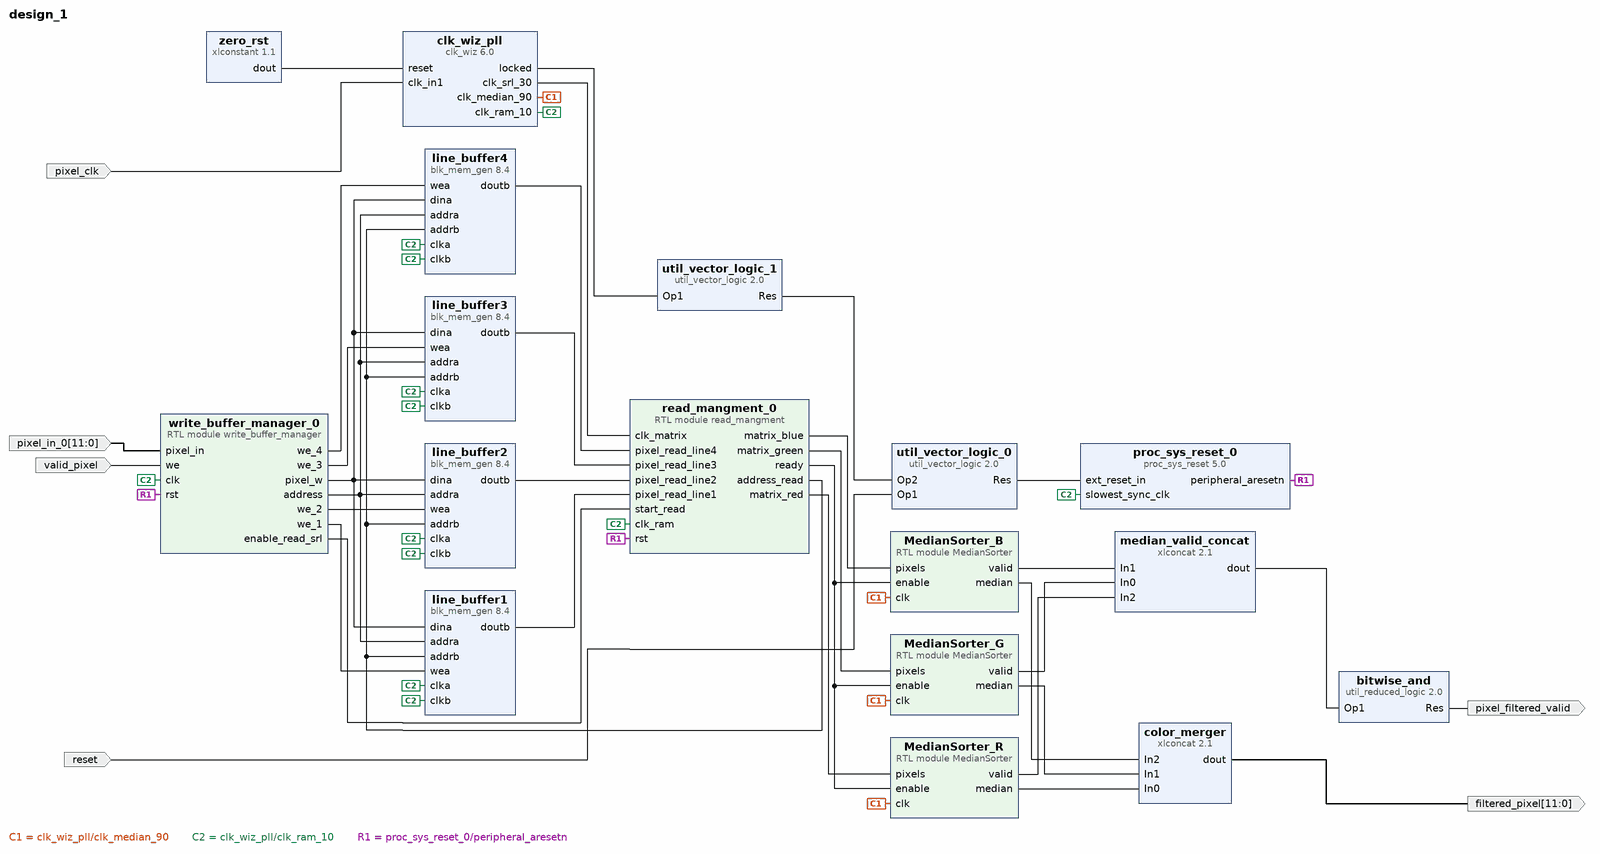
[diagram p0: block diagram of the top level]
# Vivado block design design_1, xc7a100tcsg324-1, Vivado 2024.1
create_bd_design design_1

create_bd_port -dir I -type clk pixel_clk
set_property -dict {CONFIG.FREQ_HZ 10000000} [get_bd_ports pixel_clk]
create_bd_port -dir O pixel_filtered_valid
create_bd_port -dir O -from 11 -to 0 filtered_pixel
create_bd_port -dir I -type rst reset
set_property -dict {CONFIG.POLARITY ACTIVE_HIGH} [get_bd_ports reset]
create_bd_port -dir I -from 11 -to 0 pixel_in_0
create_bd_port -dir I valid_pixel

create_bd_cell -type ip -vlnv xilinx.com:ip:blk_mem_gen:8.4 line_buffer1
set_property -dict [list \
  CONFIG.Enable_A Always_Enabled \
  CONFIG.Enable_B Always_Enabled \
  CONFIG.Fill_Remaining_Memory_Locations true \
  CONFIG.Memory_Type Simple_Dual_Port_RAM \
  CONFIG.Register_PortB_Output_of_Memory_Primitives false \
  CONFIG.Write_Depth_A 640 \
  CONFIG.Write_Width_A 12 \
  CONFIG.use_bram_block Stand_Alone \
] [get_bd_cells line_buffer1]
create_bd_cell -type ip -vlnv xilinx.com:ip:blk_mem_gen:8.4 line_buffer2
set_property -dict [list \
  CONFIG.Enable_A Always_Enabled \
  CONFIG.Enable_B Always_Enabled \
  CONFIG.Fill_Remaining_Memory_Locations true \
  CONFIG.Memory_Type Simple_Dual_Port_RAM \
  CONFIG.Register_PortB_Output_of_Memory_Primitives false \
  CONFIG.Write_Depth_A 640 \
  CONFIG.Write_Width_A 12 \
  CONFIG.use_bram_block Stand_Alone \
] [get_bd_cells line_buffer2]
create_bd_cell -type ip -vlnv xilinx.com:ip:blk_mem_gen:8.4 line_buffer3
set_property -dict [list \
  CONFIG.Enable_A Always_Enabled \
  CONFIG.Enable_B Always_Enabled \
  CONFIG.Fill_Remaining_Memory_Locations true \
  CONFIG.Memory_Type Simple_Dual_Port_RAM \
  CONFIG.Register_PortB_Output_of_Memory_Primitives false \
  CONFIG.Write_Depth_A 640 \
  CONFIG.Write_Width_A 12 \
  CONFIG.use_bram_block Stand_Alone \
] [get_bd_cells line_buffer3]
create_bd_cell -type ip -vlnv xilinx.com:ip:blk_mem_gen:8.4 line_buffer4
set_property -dict [list \
  CONFIG.Enable_A Always_Enabled \
  CONFIG.Enable_B Always_Enabled \
  CONFIG.Fill_Remaining_Memory_Locations true \
  CONFIG.Memory_Type Simple_Dual_Port_RAM \
  CONFIG.Register_PortB_Output_of_Memory_Primitives false \
  CONFIG.Write_Depth_A 640 \
  CONFIG.Write_Width_A 12 \
  CONFIG.use_bram_block Stand_Alone \
] [get_bd_cells line_buffer4]
create_bd_cell -type ip -vlnv xilinx.com:ip:clk_wiz:6.0 clk_wiz_pll
set_property -dict [list \
  CONFIG.CLKIN1_JITTER_PS 1000.0 \
  CONFIG.CLKOUT1_JITTER 933.258 \
  CONFIG.CLKOUT1_PHASE_ERROR 908.603 \
  CONFIG.CLKOUT1_REQUESTED_OUT_FREQ 10 \
  CONFIG.CLKOUT2_JITTER 760.423 \
  CONFIG.CLKOUT2_PHASE_ERROR 908.603 \
  CONFIG.CLKOUT2_REQUESTED_OUT_FREQ 30 \
  CONFIG.CLKOUT2_USED true \
  CONFIG.CLKOUT3_JITTER 657.457 \
  CONFIG.CLKOUT3_PHASE_ERROR 908.603 \
  CONFIG.CLKOUT3_REQUESTED_OUT_FREQ 90 \
  CONFIG.CLKOUT3_USED true \
  CONFIG.CLK_OUT1_PORT clk_ram_10 \
  CONFIG.CLK_OUT2_PORT clk_srl_30 \
  CONFIG.CLK_OUT3_PORT clk_median_90 \
  CONFIG.MMCM_CLKFBOUT_MULT_F 63.000 \
  CONFIG.MMCM_CLKIN1_PERIOD 100.000 \
  CONFIG.MMCM_CLKIN2_PERIOD 10.0 \
  CONFIG.MMCM_CLKOUT0_DIVIDE_F 63.000 \
  CONFIG.MMCM_CLKOUT1_DIVIDE 21 \
  CONFIG.MMCM_CLKOUT2_DIVIDE 7 \
  CONFIG.NUM_OUT_CLKS 3 \
  CONFIG.PRIM_IN_FREQ 10 \
] [get_bd_cells clk_wiz_pll]
create_bd_cell -type module -reference write_buffer_manager write_buffer_manager_0
create_bd_cell -type ip -vlnv xilinx.com:ip:xlconstant:1.1 zero_rst
set_property -dict {CONFIG.CONST_VAL 0} [get_bd_cells zero_rst]
create_bd_cell -type module -reference read_mangment read_mangment_0
create_bd_cell -type module -reference MedianSorter MedianSorter_B
create_bd_cell -type module -reference MedianSorter MedianSorter_G
create_bd_cell -type module -reference MedianSorter MedianSorter_R
create_bd_cell -type ip -vlnv xilinx.com:ip:xlconcat:2.1 median_valid_concat
set_property -dict {CONFIG.NUM_PORTS 3} [get_bd_cells median_valid_concat]
create_bd_cell -type ip -vlnv xilinx.com:ip:util_reduced_logic:2.0 bitwise_and
set_property -dict {CONFIG.C_SIZE 3} [get_bd_cells bitwise_and]
create_bd_cell -type ip -vlnv xilinx.com:ip:xlconcat:2.1 color_merger
set_property -dict {CONFIG.IN0_WIDTH 4 CONFIG.IN1_WIDTH 4 CONFIG.IN2_WIDTH 4 CONFIG.NUM_PORTS 3} [get_bd_cells color_merger]
create_bd_cell -type ip -vlnv xilinx.com:ip:proc_sys_reset:5.0 proc_sys_reset_0
set_property -dict {CONFIG.RESET_BOARD_INTERFACE reset CONFIG.USE_BOARD_FLOW true} [get_bd_cells proc_sys_reset_0]
create_bd_cell -type ip -vlnv xilinx.com:ip:util_vector_logic:2.0 util_vector_logic_0
set_property -dict {CONFIG.C_SIZE 1} [get_bd_cells util_vector_logic_0]
create_bd_cell -type ip -vlnv xilinx.com:ip:util_vector_logic:2.0 util_vector_logic_1
set_property -dict {CONFIG.C_OPERATION not CONFIG.C_SIZE 1} [get_bd_cells util_vector_logic_1]

# ---- connections ----

connect_bd_net [get_bd_pins MedianSorter_B/median] [get_bd_pins color_merger/In2]
connect_bd_net [get_bd_pins MedianSorter_B/valid] [get_bd_pins median_valid_concat/In1]
connect_bd_net [get_bd_pins MedianSorter_G/median] [get_bd_pins color_merger/In1]
connect_bd_net [get_bd_pins MedianSorter_G/valid] [get_bd_pins median_valid_concat/In0]
connect_bd_net [get_bd_pins MedianSorter_R/median] [get_bd_pins color_merger/In0]
connect_bd_net [get_bd_pins MedianSorter_R/valid] [get_bd_pins median_valid_concat/In2]
connect_bd_net -net clk_wiz_0_clk_median_90 [get_bd_pins clk_wiz_pll/clk_median_90] \
  [get_bd_pins MedianSorter_B/clk] [get_bd_pins MedianSorter_G/clk] [get_bd_pins MedianSorter_R/clk]
connect_bd_net -net clk_wiz_0_clk_srl_30 [get_bd_pins clk_wiz_pll/clk_srl_30] [get_bd_pins read_mangment_0/clk_matrix]
connect_bd_net -net clk_wiz_0_read_filt_clk [get_bd_pins clk_wiz_pll/clk_ram_10] \
  [get_bd_pins line_buffer2/clkb] [get_bd_pins line_buffer1/clkb] [get_bd_pins line_buffer3/clkb] \
  [get_bd_pins line_buffer4/clkb] [get_bd_pins line_buffer1/clka] [get_bd_pins line_buffer3/clka] \
  [get_bd_pins line_buffer2/clka] [get_bd_pins line_buffer4/clka] [get_bd_pins proc_sys_reset_0/slowest_sync_clk] \
  [get_bd_pins read_mangment_0/clk_ram] [get_bd_pins write_buffer_manager_0/clk]
connect_bd_net [get_bd_pins clk_wiz_pll/locked] [get_bd_pins util_vector_logic_1/Op1]
connect_bd_net -net clka_0_1 [get_bd_ports pixel_clk] [get_bd_pins clk_wiz_pll/clk_in1]
connect_bd_net [get_bd_pins line_buffer1/doutb] [get_bd_pins read_mangment_0/pixel_read_line1]
connect_bd_net [get_bd_pins line_buffer2/doutb] [get_bd_pins read_mangment_0/pixel_read_line2]
connect_bd_net [get_bd_pins line_buffer3/doutb] [get_bd_pins read_mangment_0/pixel_read_line3]
connect_bd_net [get_bd_pins line_buffer4/doutb] [get_bd_pins read_mangment_0/pixel_read_line4]
connect_bd_net -net pixel_in_0_1 [get_bd_ports pixel_in_0] [get_bd_pins write_buffer_manager_0/pixel_in]
connect_bd_net [get_bd_pins proc_sys_reset_0/peripheral_aresetn] [get_bd_pins read_mangment_0/rst] [get_bd_pins write_buffer_manager_0/rst]
connect_bd_net [get_bd_pins read_mangment_0/address_read] \
  [get_bd_pins line_buffer1/addrb] [get_bd_pins line_buffer3/addrb] [get_bd_pins line_buffer2/addrb] \
  [get_bd_pins line_buffer4/addrb]
connect_bd_net [get_bd_pins read_mangment_0/matrix_blue] [get_bd_pins MedianSorter_B/pixels]
connect_bd_net [get_bd_pins read_mangment_0/matrix_green] [get_bd_pins MedianSorter_G/pixels]
connect_bd_net [get_bd_pins read_mangment_0/matrix_red] [get_bd_pins MedianSorter_R/pixels]
connect_bd_net [get_bd_pins read_mangment_0/ready] \
  [get_bd_pins MedianSorter_B/enable] [get_bd_pins MedianSorter_G/enable] [get_bd_pins MedianSorter_R/enable]
connect_bd_net [get_bd_ports reset] [get_bd_pins util_vector_logic_0/Op1]
connect_bd_net -net util_reduced_logic_0_Res [get_bd_pins bitwise_and/Res] [get_bd_ports pixel_filtered_valid]
connect_bd_net [get_bd_pins util_vector_logic_0/Res] [get_bd_pins proc_sys_reset_0/ext_reset_in]
connect_bd_net [get_bd_pins util_vector_logic_1/Res] [get_bd_pins util_vector_logic_0/Op2]
connect_bd_net [get_bd_ports valid_pixel] [get_bd_pins write_buffer_manager_0/we]
connect_bd_net -net write_buffer_manager_0_address [get_bd_pins write_buffer_manager_0/pixel_w] \
  [get_bd_pins line_buffer1/dina] [get_bd_pins line_buffer2/dina] [get_bd_pins line_buffer3/dina] \
  [get_bd_pins line_buffer4/dina]
connect_bd_net [get_bd_pins write_buffer_manager_0/address] \
  [get_bd_pins line_buffer1/addra] [get_bd_pins line_buffer2/addra] [get_bd_pins line_buffer3/addra] \
  [get_bd_pins line_buffer4/addra]
connect_bd_net [get_bd_pins write_buffer_manager_0/enable_read_srl] [get_bd_pins read_mangment_0/start_read]
connect_bd_net [get_bd_pins write_buffer_manager_0/we_1] [get_bd_pins line_buffer1/wea]
connect_bd_net [get_bd_pins write_buffer_manager_0/we_2] [get_bd_pins line_buffer2/wea]
connect_bd_net [get_bd_pins write_buffer_manager_0/we_3] [get_bd_pins line_buffer3/wea]
connect_bd_net [get_bd_pins write_buffer_manager_0/we_4] [get_bd_pins line_buffer4/wea]
connect_bd_net -net xlconcat_0_dout [get_bd_pins median_valid_concat/dout] [get_bd_pins bitwise_and/Op1]
connect_bd_net -net xlconcat_1_dout [get_bd_pins color_merger/dout] [get_bd_ports filtered_pixel]
connect_bd_net -net xlconstant_0_dout [get_bd_pins zero_rst/dout] [get_bd_pins clk_wiz_pll/reset]

validate_bd_design
save_bd_design
